# Altium schematic sheet pca20020_sheet4_pin_map.SchDoc: PCA20020 - Pin Map
size A4; Organization: Nordic Semiconductor; DocumentNumber: 4; SheetNumber: 4; SheetTotal: 9; CompanyName: Nordic Semiconductor; DocumentSize: A4
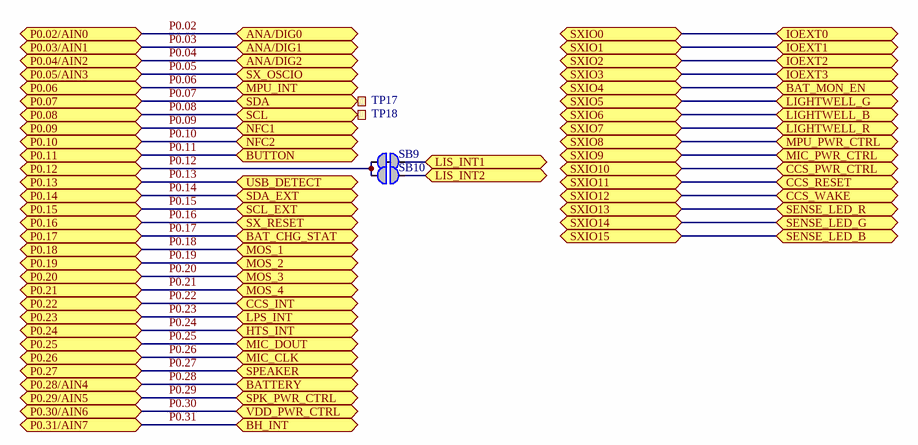
[diagram p0: pca20020_sheet4_pin_map.SchDoc]

## Parts
SB9  Solderbridge  [Solderbridge_Shorted]  (value not drawn)  (net tie, no BOM)
SB10  Solderbridge  [Solderbridge]  (value not drawn)  (no BOM)
TP17  Ø1.5mm,SMD  [TP_SMD_Ø1.5mm]  (value not drawn)  (no BOM)
TP18  Ø1.5mm,SMD  [TP_SMD_Ø1.5mm]  (value not drawn)  (no BOM)

## Ports
ANA/DIG0 (bidir), ANA/DIG1 (bidir), ANA/DIG2 (bidir), BAT_CHG_STAT (bidir), BAT_MON_EN (bidir), BATTERY (bidir), BH_INT (bidir), BUTTON (bidir), CCS_INT (bidir), CCS_PWR_CTRL (bidir), CCS_RESET (bidir), CCS_WAKE (bidir), HTS_INT (bidir), IOEXT0 (bidir), IOEXT1 (bidir), IOEXT2 (bidir), IOEXT3 (bidir), LIGHTWELL_B (bidir), LIGHTWELL_G (bidir), LIGHTWELL_R (bidir), LIS_INT1 (bidir), LIS_INT2 (bidir), LPS_INT (bidir), MIC_CLK (bidir), MIC_DOUT (bidir), MIC_PWR_CTRL (bidir), MOS_1 (bidir), MOS_2 (bidir), MOS_3 (bidir), MOS_4 (bidir), MPU_INT (bidir), MPU_PWR_CTRL (bidir), NFC1 (bidir), NFC2 (bidir), P0.02/AIN0 (bidir), P0.03/AIN1 (bidir), P0.04/AIN2 (bidir), P0.05/AIN3 (bidir), P0.06 (bidir), P0.07 (bidir), P0.08 (bidir), P0.09 (bidir), P0.10 (bidir), P0.11 (bidir), P0.12 (bidir), P0.13 (bidir), P0.14 (bidir), P0.15 (bidir), P0.16 (bidir), P0.17 (bidir), P0.18 (bidir), P0.19 (bidir), P0.20 (bidir), P0.21 (bidir), P0.22 (bidir), P0.23 (bidir), P0.24 (bidir), P0.25 (bidir), P0.26 (bidir), P0.27 (bidir), P0.28/AIN4 (bidir), P0.29/AIN5 (bidir), P0.30/AIN6 (bidir), P0.31/AIN7 (bidir), SCL (bidir), SCL_EXT (bidir), SDA (bidir), SDA_EXT (bidir), SENSE_LED_B (bidir), SENSE_LED_G (bidir), SENSE_LED_R (bidir), SPEAKER (bidir), SPK_PWR_CTRL (bidir), SX_OSCIO (bidir), SX_RESET (bidir), SXIO0 (bidir), SXIO1 (bidir), SXIO2 (bidir), SXIO3 (bidir), SXIO4 (bidir), SXIO5 (bidir), SXIO6 (bidir), SXIO7 (bidir), SXIO8 (bidir), SXIO9 (bidir), SXIO10 (bidir), SXIO11 (bidir), SXIO12 (bidir), SXIO13 (bidir), SXIO14 (bidir), SXIO15 (bidir), USB_DETECT (bidir), VDD_PWR_CTRL (bidir)

## Nets
BAT_MON_EN: port SXIO4, port BAT_MON_EN
CCS_PWR_CTRL: port CCS_PWR_CTRL, port SXIO10
CCS_RESET: port CCS_RESET, port SXIO11
CCS_WAKE: port CCS_WAKE, port SXIO12
IOEXT0: port SXIO0, port IOEXT0
IOEXT1: port SXIO1, port IOEXT1
IOEXT2: port SXIO2, port IOEXT2
IOEXT3: port SXIO3, port IOEXT3
LIGHTWELL_B: port SXIO6, port LIGHTWELL_B
LIGHTWELL_G: port SXIO5, port LIGHTWELL_G
LIGHTWELL_R: port SXIO7, port LIGHTWELL_R
LIS_INT1: SB9.1 ; port LIS_INT1
LIS_INT2: SB10.1 ; port LIS_INT2
MIC_PWR_CTRL: port MIC_PWR_CTRL, port SXIO9
MPU_PWR_CTRL: port MPU_PWR_CTRL, port SXIO8
P0.02: port P0.02/AIN0, port ANA/DIG0
P0.03: port P0.03/AIN1, port ANA/DIG1
P0.04: port P0.04/AIN2, port ANA/DIG2
P0.05: port P0.05/AIN3, port SX_OSCIO
P0.06: port MPU_INT, port P0.06
P0.07: TP17.1 ; port SDA, port P0.07
P0.08: TP18.1 ; port SCL, port P0.08
P0.09: port NFC1, port P0.09
P0.10: port NFC2, port P0.10
P0.11: port P0.11, port BUTTON
P0.12: SB9.2 SB10.2 ; port P0.12
P0.13: port P0.13, port USB_DETECT
P0.14: port P0.14, port SDA_EXT
P0.15: port P0.15, port SCL_EXT
P0.16: port P0.16, port SX_RESET
P0.17: port P0.17, port BAT_CHG_STAT
P0.18: port MOS_1, port P0.18
P0.19: port MOS_2, port P0.19
P0.20: port MOS_3, port P0.20
P0.21: port MOS_4, port P0.21
P0.22: port P0.22, port CCS_INT
P0.23: port LPS_INT, port P0.23
P0.24: port P0.24, port HTS_INT
P0.25: port MIC_DOUT, port P0.25
P0.26: port MIC_CLK, port P0.26
P0.27: port SPEAKER, port P0.27
P0.28: port BATTERY, port P0.28/AIN4
P0.29: port P0.29/AIN5, port SPK_PWR_CTRL
P0.30: port P0.30/AIN6, port VDD_PWR_CTRL
P0.31: port P0.31/AIN7, port BH_INT
SENSE_LED_B: port SXIO15, port SENSE_LED_B
SENSE_LED_G: port SXIO14, port SENSE_LED_G
SENSE_LED_R: port SXIO13, port SENSE_LED_R

## Notes on the sheet
- Title
- Size
- Date:
- A4
- Project Number
- Sheet         of
- Revision
- File:
- Drawn By:

## Library data of the parts
SB9 = Solderbridge Shorted: Shorted Solderbridge; Artikkelnr Noca: N.A.; Part Number: Solderbridge Shorted; Manufacturer: *; Manufacturer Part Number: *; Footprint Doc: Solderbridge_Shorted; LatestRevisionDate: 2012-08-07; Pin Count: 2; Publisher: Nordic Semiconductor; Published: 2012-08-07; Value: Solderbridge; Note: *; Part number IPS: N.A.; ComponentLink1URL: *; ComponentLink1Description: Datasheet; ComponentLink2URL: *; ComponentLink2Description: Supplier link; HelpURL: *; Supplier 1: *; Supplier Part Number 1: *; Supplier 2: *; Supplier Part Number 2: *
SB10 = Solderbridge: Artikkelnr Noca: N.A.; Part Number: Solderbridge; Manufacturer: *; Manufacturer Part Number: *; Footprint Doc: Solderbridge; LatestRevisionDate: 2009-12-14; Pin Count: 2; Publisher: Nordic Semiconductor; Published: 2009-12-14; Value: Solderbridge; Note: *; Part number IPS: N.A.; ComponentLink1URL: *; ComponentLink1Description: Datasheet; ComponentLink2URL: *; ComponentLink2Description: Supplier link; HelpURL: *; Supplier 1: *; Supplier Part Number 1: *; Supplier 2: *; Supplier Part Number 2: *
TP17 TP18 = TP_SMD_Ø1.5MM: 1.0mm circular SMD testpad; Manufacturer: Nordic Semiconductor; Artikkelnr Noca: N.A.; Part Number: TP_SMD_Ø1.5MM; Manufacturer Part Number: *; Footprint Doc: TP_SMD_Ø1.5mm; LatestRevisionDate: 2016-06-02; Pin Count: 1; Publisher: Nordic Semiconductor; Published: 2016-06-02; Value: Ø1.5mm,SMD; Note: *; Part number IPS: N.A.; ComponentLink1URL: *; ComponentLink1Description: Datasheet; ComponentLink2URL: *; ComponentLink2Description: Supplier link; HelpURL: *; Supplier 1: *; Supplier Part Number 1: *; Supplier 2: *; Supplier Part Number 2: *